# Altium schematic sheet w43TrafficLight_schematic.SchDoc
size B
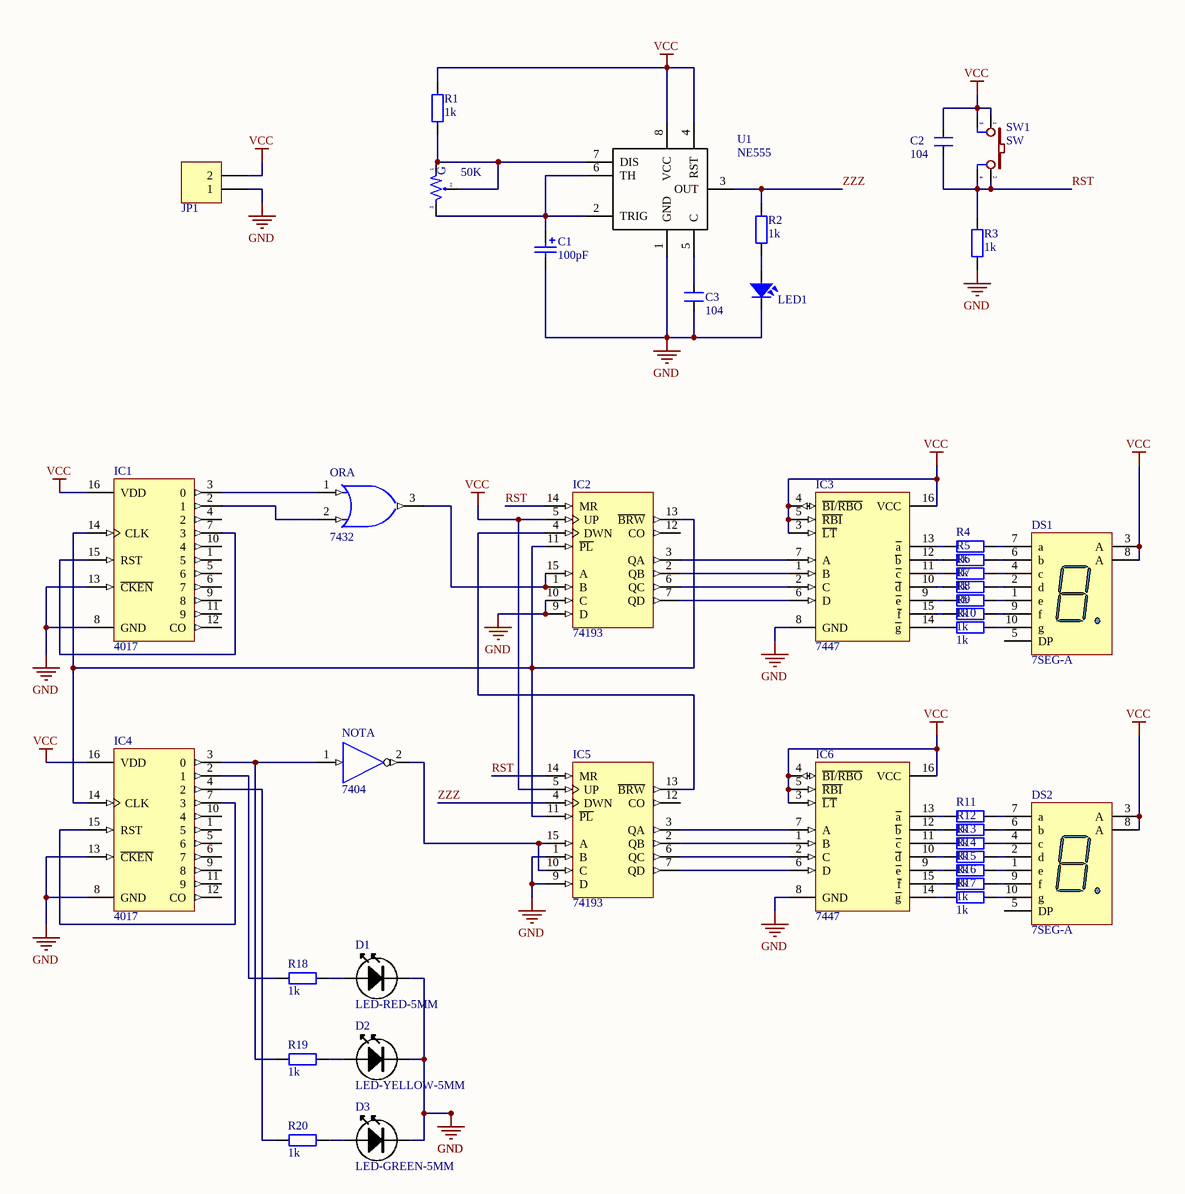
[diagram p0: w43TrafficLight_schematic.SchDoc]

## Parts
C1  value 100pF  [CP1/2]  (hidden comment: Cap Pol)
C2  104  [CN150]
C3  104  [CN150]
D1  LED-RED-5MM  [LED-5MM-RED]
D2  LED-YELLOW-5MM  [LED-5MM-YELLOW]
D3  LED-GREEN-5MM  [LED-5MM-GREEN]
DS1  7SEG-A  [LED7SEG]
DS2  7SEG-A  [LED7SEG]
IC1  4017  [DIP16]
IC2  74193  [DIP16/W0.3]
IC3  7447  [DIP16]
IC4  4017  [DIP16]
IC5  74193  [DIP16/W0.3]
IC6  7447  [DIP16]
JP1  Header 2_1  [HED2]  (value not drawn)
LED1  LED  [LED-3MM-WHITE]  (value not drawn)
NOT  7404  [DIP14/W0.3]  (part A of 6)
OR  7432  [DIP14/W0.3]  (part A of 4)
R1  1k  [R1/4W]
R2  1k  [R1/4W]
R3  1k  [R1/4W]
R4  1k  [R1/4W]
R5  1k  [R1/4W]
R6  1k  [R1/4W]
R7  1k  [R1/4W]
R8  1k  [R1/4W]
R9  1k  [R1/4W]
R10  1k  [R1/4W]
R11  1k  [R1/4W]
R12  1k  [R1/4W]
R13  1k  [R1/4W]
R14  1k  [R1/4W]
R15  1k  [R1/4W]
R16  1k  [R1/4W]
R17  1k  [R1/4W]
R18  1k  [R1/4W]
R19  1k  [R1/4W]
R20  1k  [R1/4W]
SW1  SW  [SW4]
U1  NE555  [DIP8]
VR1  50K  [VR-S1]

## Nets
GND: C1.2 C3.1 D1.K D2.K D3.K IC1.8(GND) IC1.13(~{CKEN}) IC2.8(GND) IC2.9(D) IC2.10(C) IC3.8(GND) IC4.8(GND) IC4.13(~{CKEN}) IC5.1(B) IC5.8(GND) IC5.9(D) IC6.8(GND) JP1.1 LED1.2 NOT.7(GND) OR.7(GND) R3.1 U1.1(GND)
VCC: C2.2 DS1.3(A) DS1.8(A) DS2.3(A) DS2.8(A) IC1.16(VDD) IC2.5(UP) IC2.16(VCC) IC3.3(~{LT}) IC3.4(~{BI}/~{RBO}) IC3.5(~{RBI}) IC3.16(VCC) IC4.16(VDD) IC5.5(UP) IC5.16(VCC) IC6.3(~{LT}) IC6.4(~{BI}/~{RBO}) IC6.5(~{RBI}) IC6.16(VCC) JP1.2 NOT.14(VCC) OR.14(VCC) R1.2 SW1.1 SW1.3 U1.4(RST) U1.8(VCC)
RST: C2.1 IC2.14(MR) IC5.14(MR) R3.2 SW1.2 SW1.4
ZZZ: IC5.4(DWN) R2.2 U1.3(OUT)
NetC1_1: C1.1 U1.2(TRIG) U1.6(TH) VR1.3
NetC3_2: C3.2 U1.5(C)
NetD1_A: D1.A R18.2
NetD2_A: D2.A R19.2
NetD3_A: D3.A R20.2
NetDS1_1: DS1.1(e) R8.2
NetDS1_2: DS1.2(d) R7.2
NetDS1_4: DS1.4(c) R6.2
NetDS1_6: DS1.6(b) R5.2
NetDS1_7: DS1.7(a) R4.2
NetDS1_9: DS1.9(f) R9.2
NetDS1_10: DS1.10(g) R10.2
NetDS2_1: DS2.1(e) R15.2
NetDS2_2: DS2.2(d) R14.2
NetDS2_4: DS2.4(c) R13.2
NetDS2_6: DS2.6(b) R12.2
NetDS2_7: DS2.7(a) R11.2
NetDS2_9: DS2.9(f) R16.2
NetDS2_10: DS2.10(g) R17.2
NetIC1_2: IC1.2(1) OR.2(B)
NetIC1_3: IC1.3(0) OR.1(A)
NetIC1_7: IC1.7(3) IC1.15(RST)
NetIC1_14: IC1.14(CLK) IC2.11(~{PL}) IC2.13(~{BRW}) IC4.14(CLK) IC5.11(~{PL})
NetIC2_1: IC2.1(B) IC2.15(A) OR.3(Y)
NetIC2_2: IC2.2(QB) IC3.1(B)
NetIC2_3: IC2.3(QA) IC3.7(A)
NetIC2_4: IC2.4(DWN) IC5.13(~{BRW})
NetIC2_6: IC2.6(QC) IC3.2(C)
NetIC2_7: IC2.7(QD) IC3.6(D)
NetIC3_9: IC3.9(~{e}) R8.1
NetIC3_10: IC3.10(~{d}) R7.1
NetIC3_11: IC3.11(~{c}) R6.1
NetIC3_12: IC3.12(~{b}) R5.1
NetIC3_13: IC3.13(~{a}) R4.1
NetIC3_14: IC3.14(~{g}) R10.1
NetIC3_15: IC3.15(~{f}) R9.1
NetIC4_2: IC4.2(1) R18.1
NetIC4_3: IC4.3(0) NOT.1(A) R19.1
NetIC4_4: IC4.4(2) R20.1
NetIC4_7: IC4.7(3) IC4.15(RST)
NetIC5_2: IC5.2(QB) IC6.1(B)
NetIC5_3: IC5.3(QA) IC6.7(A)
NetIC5_6: IC5.6(QC) IC6.2(C)
NetIC5_7: IC5.7(QD) IC6.6(D)
NetIC5_10: IC5.10(C) IC5.15(A) NOT.2(~{O})
NetIC6_9: IC6.9(~{e}) R15.1
NetIC6_10: IC6.10(~{d}) R14.1
NetIC6_11: IC6.11(~{c}) R13.1
NetIC6_12: IC6.12(~{b}) R12.1
NetIC6_13: IC6.13(~{a}) R11.1
NetIC6_14: IC6.14(~{g}) R17.1
NetIC6_15: IC6.15(~{f}) R16.1
NetLED1_1: LED1.1 R2.1
NetR1_1: R1.1 U1.7(DIS) VR1.1 VR1.2

Not connected (* = marked no-connect by the designer): DS1 5(DP); DS2 5(DP); IC1 1(5) 4(2) 5(6) 6(7) 9(8) 10(4) 11(9) 12(CO); IC2 12(CO); IC4 1(5) 5(6) 6(7) 9(8) 10(4) 11(9) 12(CO); IC5 12(CO)

## Notes on the sheet
- (in symbol VR-S) G

## Library data of the parts
C1 = Cap Pol: Polarized Capacitor (Radial)
C2 C3 = CN1.5: Capacitor Ceramic; Value: 0.01uF
DS1 DS2 = LED7SEG-A: 14.2 mm General Purpose Blue 7-Segment Display: CA, RH DP, Gray Surface; MinimumIntensity: 2020 ucd; Note: IF = 10 mA; Published: 8-Jun-2000; LatestRevisionDate: 17-Dec-2003; LatestRevisionNote: Schematic revised, PCB Footprint replaced.; DatasheetDocument: 24-Sep-2002; PackageDocument: 24-Sep-2002; PackageReference: H; Publisher: Altium Limited; Colour: Blue; ComponentLink1Description: Manufacturer Link; ComponentLink1URL: http://www.agilent.com/
IC1 IC4 = 4017: Decade Counter/Divider with 10 Decoded Outputs; Designed by: VanDungEvn; Value: CD4017
IC2 IC5 = 74193: Synchronous 4-Bit Up/Down Counter; Value: 74193; Copyright by: VanDungEvn@Gmail.com
IC3 IC6 = 7447: BCD to 7-Segment Decoder/Driver; Value: 7447 , 74247
JP1 = Header 2_1: Header, 2-Pin; Manufacturer: Generic Components; Class: Connector; Value: Header 2
LED1 = LED: LED Single colour Green and Red; Value: LED 3 ly Single Colour
NOT = 7404: Hex Inverter; Code_IPC: SOIC127P600-14; ComponentLink1Description: Manufacturer Link; ComponentLink1URL: http://www.national.com/; ComponentLink2Description: Datasheet; ComponentLink2URL: http://www.fairchildsemi.com/ds/74/74F04.pdf; Value: 7404
OR = 7432: Quad 2-Input OR Gate
R1-R20 = R1/4W: Resistor 1/4W; Value: R1/4W - 1K
SW1 = SW4-1: Switch button 4 pin; Value: SW chip 4 pin
U1 = NE555: TIMER IC; Manufacturer Part Number: NE555DT; Manufacturer: STMicroelectronics; Frequency: 500kHz; Voltage - Supply: 4.5 V ~ 16 V; Current: 200mA; Supplier 1: Digi-Key; Supplier Part Number 1: 497-1962-2-ND; Supplier: Digi-Key; Category: Integrated Circuits (ICs); Supplier Part Number: 497-1962-2-ND; Package / Case: 8-SOIC (3.9mm Width); Packaging: Tape & Reel (TR); RoHS: RoHS Compliant; Operating Temperature: 0°C ~ 70°C; Count: -; Type: 555 Type, Timer/Oscillator (Single)
VR1 = VR-S: Var Resistor; Value: Volume 50k